# EAGLE design sanguino (EAGLE 5.10)
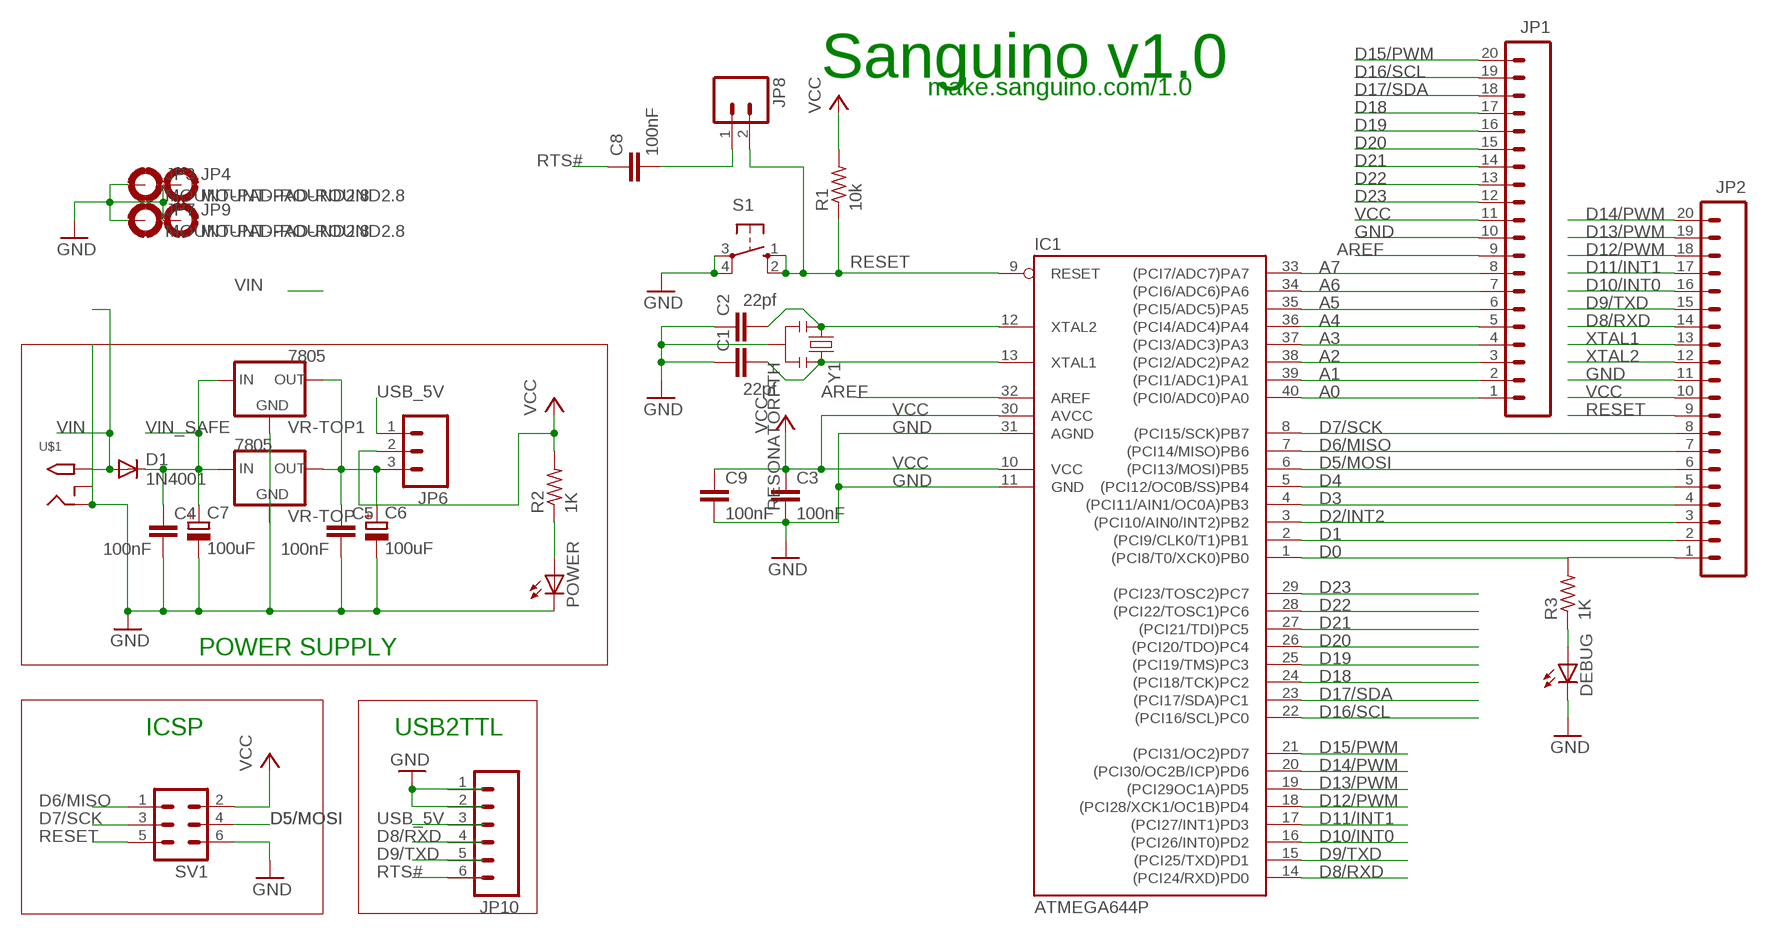
[diagram p0: schematic, sheet 1]

## Parts
C1  22pf  C-EU025-025X050  [C025-025X050]
C2  22pf  C-EU025-025X050  [C025-025X050]
C3  100nF  C-EU050-030X075  [C050-030X075]
C4  100nF  C-EU050-030X075  [C050-030X075]
C5  100nF  C-EU050-030X075  [C050-030X075]
C6  100uF  CPOL-EUE2.5-6  [E2,5-6]
C7  100uF  CPOL-EUE2.5-6  [E2,5-6]
C8  100nF  C-EU050-030X075  [C050-030X075]
C9  100nF  C-EU050-030X075  [C050-030X075]
D1  1N4001  1N4004  [DO41-10]
DEBUG  LED3MM  [LED3MM]
IC1  ATMEGA644P  ATMEGA644-20P  [DIL40]
JP1  M20LOCK  [1X20_LOCK]
JP2  M20LOCK  [1X20_LOCK]
JP3  MOUNT-PAD-ROUND2.8  [2,8-PAD]
JP4  MOUNT-PAD-ROUND2.8  [2,8-PAD]
JP6  M03LOCK  [1X03_LOCK]
JP7  MOUNT-PAD-ROUND2.8  [2,8-PAD]
JP8  M02LOCK  [1X02_LOCK]
JP9  MOUNT-PAD-ROUND2.8  [2,8-PAD]
JP10  M06LOCK  [1X06_LOCK]
POWER  LED3MM  [LED3MM]
R1  10k  R-US_0207/2V  [0207/2V]
R2  1K  R-US_0207/2V  [0207/2V]
R3  1K  R-US_0207/7  [0207/7]
S1  10-XX  [B3F-10XX]
SV1  ML6  [ML6]
U$1  2.1MMJACKTHM  [PJ-102A-DOUBLE_SIDED]
VR-TOP  7805  V_REG_78XXSINK  [TO220-IGO]
VR-TOP1  7805  V_REG_78XXSINK  [TO220-IGO]
Y1  RESONATORPTH  [RESONATOR-PTH]

## Nets
A0: IC1.40((PCI0/ADC0)PA0) JP1.1
A1: IC1.39((PCI1/ADC1)PA1) JP1.2
A2: IC1.38((PCI2/ADC2)PA2) JP1.3
A3: IC1.37((PCI3/ADC3)PA3) JP1.4
A4: IC1.36((PCI4/ADC4)PA4) JP1.5
A5: IC1.35((PCI5/ADC5)PA5) JP1.6
A6: IC1.34((PCI6/ADC6)PA6) JP1.7
A7: IC1.33((PCI7/ADC7)PA7) JP1.8
AREF: IC1.32(AREF) JP1.9
D0: IC1.1((PCI8/T0/XCK0)PB0) JP2.1 R3.2
D1: IC1.2((PCI9/CLK0/T1)PB1) JP2.2
D2/INT2: IC1.3((PCI10/AIN0/INT2)PB2) JP2.3
D3: IC1.4((PCI11/AIN1/OC0A)PB3) JP2.4
D4: IC1.5((PCI12/OC0B/SS)PB4) JP2.5
D5/MOSI: IC1.6((PCI13/MOSI)PB5) JP2.6 SV1.4
D6/MISO: IC1.7((PCI14/MISO)PB6) JP2.7 SV1.1
D7/SCK: IC1.8((PCI15/SCK)PB7) JP2.8 SV1.3
D8/RXD: IC1.14((PCI24/RXD)PD0) JP2.14 JP10.4
D9/TXD: IC1.15((PCI25/TXD)PD1) JP2.15 JP10.5
D10/INT0: IC1.16((PCI26/INT0)PD2) JP2.16
D11/INT1: IC1.17((PCI27/INT1)PD3) JP2.17
D12/PWM: IC1.18((PCI28/XCK1/OC1B)PD4) JP2.18
D13/PWM: IC1.19((PCI29OC1A)PD5) JP2.19
D14/PWM: IC1.20((PCI30/OC2B/ICP)PD6) JP2.20
D15/PWM: IC1.21((PCI31/OC2)PD7) JP1.20
D16/SCL: IC1.22((PCI16/SCL)PC0) JP1.19
D17/SDA: IC1.23((PCI17/SDA)PC1) JP1.18
D18: IC1.24((PCI18/TCK)PC2) JP1.17
D19: IC1.25((PCI19/TMS)PC3) JP1.16
D20: IC1.26((PCI20/TDO)PC4) JP1.15
D21: IC1.27((PCI21/TDI)PC5) JP1.14
D22: IC1.28((PCI22/TOSC1)PC6) JP1.13
D23: IC1.29((PCI23/TOSC2)PC7) JP1.12
GND: C1.1 C2.1 C3.2 C4.2 C5.2 C6.- C7.- C9.2 DEBUG.K(C) IC1.11(GND) IC1.31(AGND) JP1.10 JP2.11 JP3.B2,8(MOUNT) JP4.B2,8(MOUNT) JP7.B2,8(MOUNT) JP9.B2,8(MOUNT) JP10.1 JP10.2 POWER.K(C) S1.3(P) S1.4(P1) SV1.6 U$1.RING VR-TOP1.GND VR-TOP.GND Y1.2
N$4: POWER.A R2.1
N$7: DEBUG.A R3.1
N$21: C8.2 JP8.1
RESET: IC1.9(RESET) JP2.9 JP8.2 R1.1 S1.1(S) S1.2(S1) SV1.5
RTS#: C8.1 JP10.6
USB_5V: JP6.1 JP10.3
VCC [power]: C3.1 C9.1 IC1.10(VCC) IC1.30(AVCC) JP1.11 JP2.10 JP6.2 R1.2 R2.2 SV1.2
VIN [power]: D1.A U$1.TIP
VIN_SAFE [power]: C4.1 C7.+ D1.C VR-TOP1.IN VR-TOP.IN
VREG-OUT: C5.1 C6.+ JP6.3 VR-TOP1.OUT VR-TOP.OUT
XTAL1: C1.2 IC1.13(XTAL1) JP2.13 Y1.3
XTAL2: C2.2 IC1.12(XTAL2) JP2.12 Y1.1
Unconnected: U$1.RING_SW

## Notes on the sheet
- Sanguino v1.0
- make.sanguino.com/1.0
- POWER SUPPLY
- ICSP | USB2TTL

## Library data of the parts
C1-C5 C8 C9 = rcl:C-EU: CAPACITOR, European symbol
C6 C7 = rcl:CPOL-EU: POLARIZED CAPACITOR, European symbol
D1 = diode:1N4004: DIODE general purpose rectifier, 1 A
DEBUG POWER = led:LED: LED OSRAM: - CHIPLED LG R971, LG N971, LY N971, LG Q971, LY Q971, LO R971, LY R971 LH N974, LH R974 LS Q976, LO Q976, LY Q976 LO Q996 - Hyper CHIPLED LW Q18S LB Q993, LB Q99A, LB R99A - SideLED LS A670, LO A670, LY A670, LG A670, LP A670 LB A673, LV A673, LT A673, LW A673 LH A674 LY A675 LS A676, LA A676, LO A676, LY A676, LW A676 LS A679, LY A679, LG A679 - Hyper Micro SIDELED® LS Y876, LA Y876, LO Y876, LY Y876 LT Y87S - SmartLED LW L88C, LW L88S LB L89C, LB L89S, LG L890 LS L89K, LO L89K, LY L89K LS L896, LA L896, LO L896, LY L896 - TOPLED LS T670, LO T670, LY T670, LG T670, LP T670 LSG T670, LSP T670, LSY T670, LOP T670, LYG T670 LG T671, LOG T671, LSG T671 LB T673, LV T673, LT T673, LW T673 LH T674 LS T676, LA T676, LO T676, LY T676, LB T676, LH T676, LSB T676, LW T676 LB T67C, LV T67C, LT T67C, LS T67K, LO T67K, LY T67K, LW E67C LS E67B, LA E67B, LO E67B, LY E67B, LB E67C, LV E67C, LT E67C LW T67C LS T679, LY T679, LG T679 LS T770, LO T770, LY T770, LG T770, LP T770 LB T773, LV T773, LT T773, LW T773 LH T774 LS E675, LA E675, LY E675, LS T675 LS T776, LA T776, LO T776, LY T776, LB T776 LHGB T686 LT T68C, LB T68C - Hyper Mini TOPLED® LB M676 - Mini TOPLED Santana® LG M470 LS M47K, LO M47K, LY M47K Source: http://www.osram.convergy.de - LUMILED® LXK2-PW12-R00, LXK2-PW12-S00, LXK2-PW14-U00, LXK2-PW14-V00 LXK2-PM12-R00, LXK2-PM12-S00, LXK2-PM14-U00 LXK2-PE12-Q00, LXK2-PE12-R00, LXK2-PE12-S00, LXK2-PE14-T00, LXK2-PE14-U00 LXK2-PB12-K00, LXK2-PB12-L00, LXK2-PB12-M00, LXK2-PB14-N00, LXK2-PB14-P00, LXK2-PB14-Q00 LXK2-PR12-L00, LXK2-PR12-M00, LXK2-PR14-Q00, LXK2-PR14-R00 LXK2-PD12-Q00, LXK2-PD12-R00, LXK2-PD12-S00 LXK2-PH12-R00, LXK2-PH12-S00 LXK2-PL12-P00, LXK2-PL12-Q00, LXK2-PL12-R00 Source: www.luxeon.com
IC1 = avr:ATMEGA644*P: MICROCONTROLLER 64 kBytes FLASH 4 kBytes SRAM 2 kBytes EEPROM DUAL USART 8-channel 10 bit ADC
JP1 JP2 = SparkFun:M20: This is just like the LOCK variant in that the holes are staggared by 5 mil, but except for the last two holes. They are not altered from the "standard" footprint layout. This is used for a special purpose on the layout of our Graphic LCD Backpack. Make sure you want to use this device before selecting it for you project!
JP3 JP4 JP7 JP9 = holes:MOUNT-PAD-ROUND: MOUNTING PAD, round
JP6 = SparkFun:M03: Header 3 Standard 3-pin 0.1" header. Use with straight break away headers (SKU : PRT-00116), right angle break away headers (PRT-00553), swiss pins (PRT-00743), machine pins (PRT-00117), and female headers (PRT-00115). Molex polarized connector foot print use with SKU : PRT-08232 with associated crimp pins and housings.
JP8 = SparkFun:M02: Header 2 Standard 2-pin 0.1" header. Use with straight break away headers (SKU : PRT-00116), right angle break away headers (PRT-00553), swiss pins (PRT-00743), machine pins (PRT-00117), and female headers (PRT-00115). Molex polarized connector foot print use with SKU : PRT-08233 with associated crimp pins and housings.
JP10 = SparkFun:M06: Header 6 Standard 6-pin 0.1" header. Use with straight break away headers (SKU : PRT-00116), right angle break away headers (PRT-00553), swiss pins (PRT-00743), machine pins (PRT-00117), and female headers (PRT-00115). Molex polarized connector foot print use with SKU : PRT-08094 with associated crimp pins and housings. NOTES ON THE VARIANTS LOCK and LOCK_LONGPADS... This footprint was designed to help hold the alignment of a through-hole component (i.e. 6-pin header) while soldering it into place. You may notice that each hole has been shifted either up or down by 0.005 of an inch from it's more standard position (which is a perfectly straight line). This slight alteration caused the pins (the squares in the middle) to touch the edges of the holes. Because they are alternating, it causes a "brace" to hold the component in place. 0.005 has proven to be the perfect amount of "off-center" position when using our standard breakaway headers. Although looks a little odd when you look at the bare footprint, once you have a header in there, the alteration is very hard to notice. Also, if you push a header all the way into place, it is covered up entirely on the bottom side. This idea of altering the position of holes to aid alignment will be further integrated into the Sparkfun Library for other footprints. It can help hold any component with 3 or more connection pins.
R1 R3 = adafruit:R-US_: RESISTOR, American symbol
R2 = rcl:R-US_: RESISTOR, American symbol
S1 = switch-omron:10-XX: OMRON SWITCH
SV1 = con-harting-ml:ML6: HARTING
U$1 = ideabot:2.1MMJACK: 2.1mm x 5.5mm THM DC jack with internal switch. Digikey part #PJ-102A, 4UCON part #05537 2.1mm x 5.5mm SMT DC jack with internal switch. Digikey part #PJ-002A-SMT, 4UCON part #03267 By microbuilder.eu & adafruit.com
VR-TOP VR-TOP1 = SparkFun:V_REG_78XX: Voltage Regulator Standard 7805 5V regulator. IGO (Input Ground Output). Spark Fun Electronics SKU : COM-00107
Y1 = SparkFun:RESONATOR: Resonator Small SMD resonator. This is the itty bitty 10/20MHz resonators with built in caps. CSTCE10M0G55 and CSTCE20M0V53. Footprint has been reviewed closely but hasn't been tested yet.

## Net classes
0 default: width 0.635 mm, clearance 0.406 mm
1 power: width 0.635 mm, clearance 0.406 mm

## Board
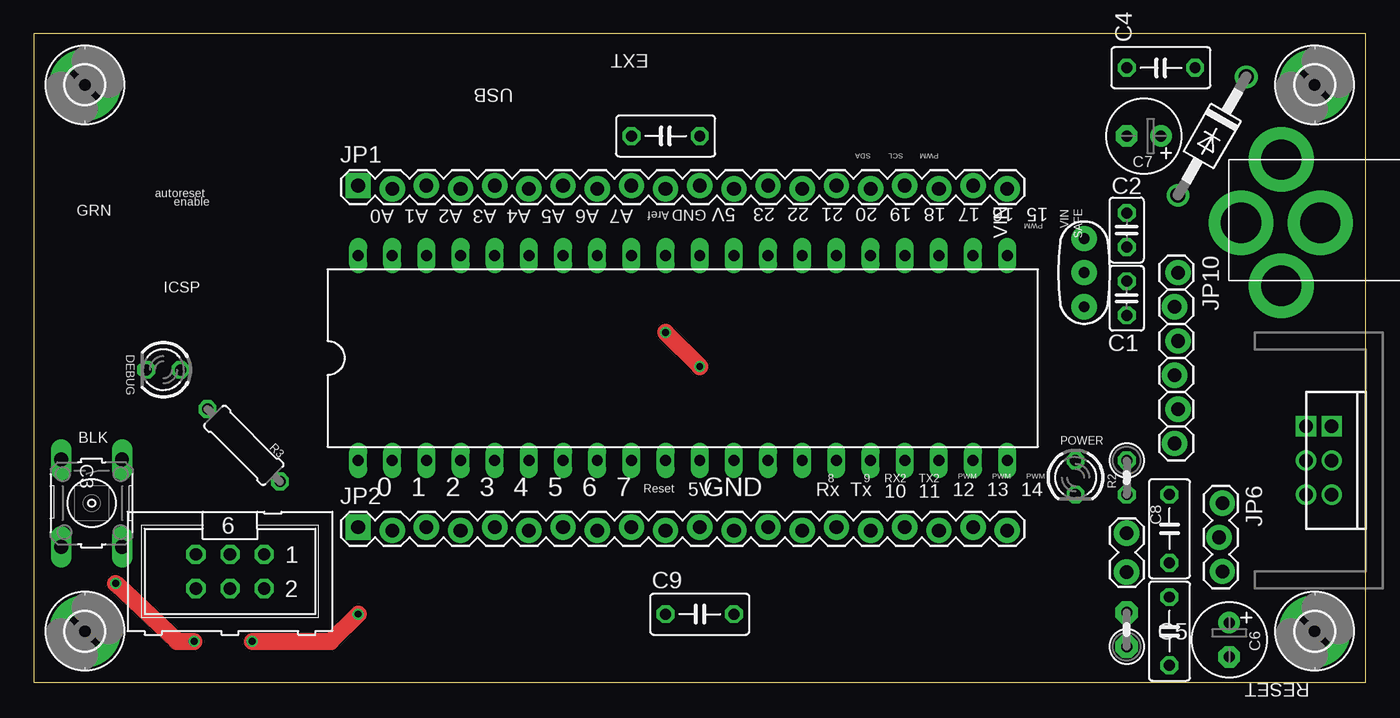
[diagram p1: board, top side]
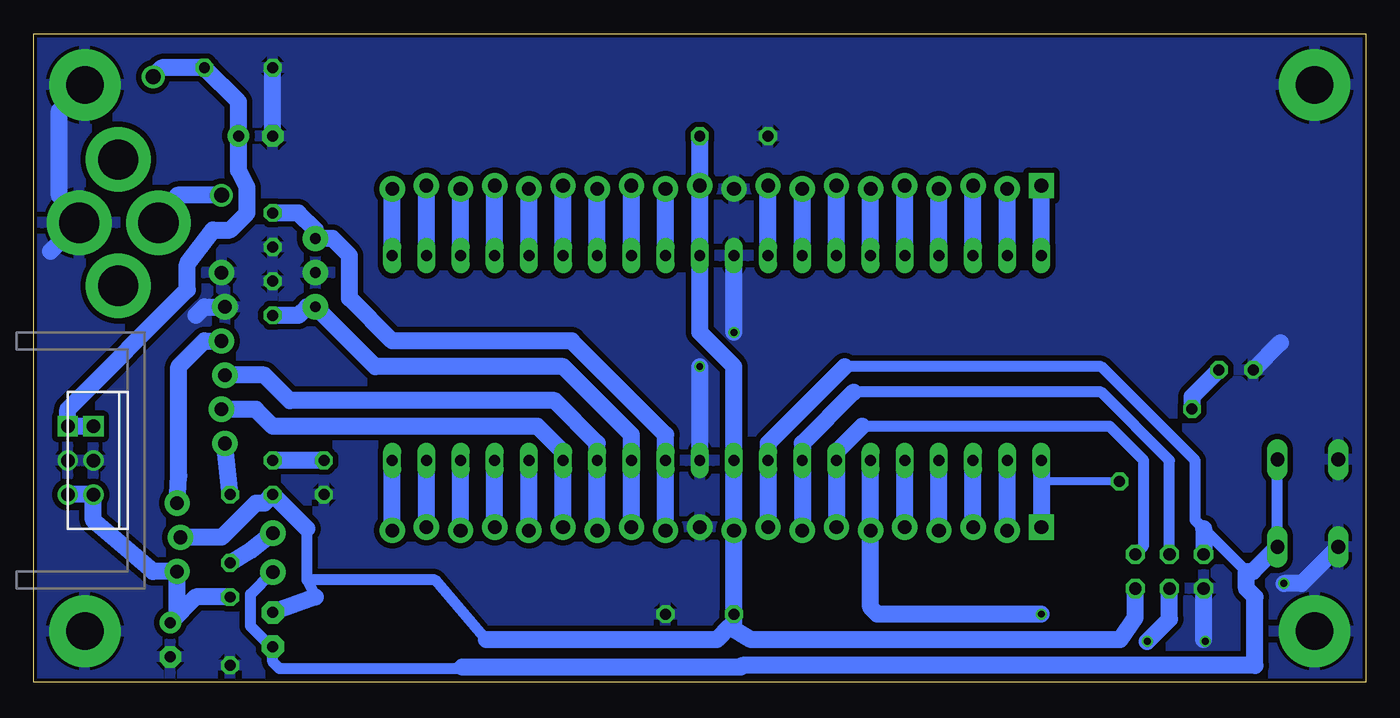
[diagram p2: board, bottom side, seen from below]

Size 99.06 x 48.26 mm. Coordinates in mm from the lower left corner, seen from the top.
Outline: 0,0 99.06,0 99.06,48.26 0,48.26 0,0
Copper layers (1*16): Top 0.035mm / dielectric 1.5mm / Bottom 0.035mm
Design rules "Fusion_eagle_rule_v1.1": minimum track width 6mil, minimum drill 12mil, track to track 6mil, track to pad 6mil, pad to pad 6mil, via to via 6mil, smd to smd 0mil, copper to edge 10mil, drill to drill 10mil, minimum pad ring 10mil, minimum via ring 6mil, stop-mask expansion 2mil, vias tented up to drill 100mil, thermal gap 10mil

### Footprints (pad centres in the part's own frame; a part is rotated, then mirrored left to right if it is on the bottom)
C025-025X050 = drill 0.813 octagon: 1 -1.27,0; 2 1.27,0
C050-030X075 = drill 0.813 octagon: 1 -2.54,0; 2 2.54,0
E2,5-6 = drill 0.813 pad 1.6 round: + -1.27,0 | drill 0.813 pad 1.6 octagon: - 1.27,0
DO41-10 = drill 1.118 round: A 5.08,0; C -5.08,0
LED3MM = drill 0.813 octagon: A -1.27,0; K 1.27,0
DIL40 = drill 0.813 long: 1 -24.13,-7.62; 2 -21.59,-7.62; 3 -19.05,-7.62; 4 -16.51,-7.62; 5 -13.97,-7.62; 6 -11.43,-7.62; 7 -8.89,-7.62; 8 -6.35,-7.62; 9 -3.81,-7.62; 10 -1.27,-7.62; 11 1.27,-7.62; 12 3.81,-7.62; 13 6.35,-7.62; 14 8.89,-7.62; 15 11.43,-7.62; 16 13.97,-7.62; 17 16.51,-7.62; 18 19.05,-7.62; 19 21.59,-7.62; 20 24.13,-7.62; 21 24.13,7.62; 22 21.59,7.62; 23 19.05,7.62; 24 16.51,7.62; 25 13.97,7.62; 26 11.43,7.62; 27 8.89,7.62; 28 6.35,7.62; 29 3.81,7.62; 30 1.27,7.62; 31 -1.27,7.62; 32 -3.81,7.62; 33 -6.35,7.62; 34 -8.89,7.62; 35 -11.43,7.62; 36 -13.97,7.62; 37 -16.51,7.62; 38 -19.05,7.62; 39 -21.59,7.62; 40 -24.13,7.62
1X20_LOCK = drill 1.016 pad 1.88 square: 1 0,0.127 | drill 1.016 pad 1.88 round: 2 2.54,-0.127; 3 5.08,0.127; 4 7.62,-0.127; 5 10.16,0.127; 6 12.7,-0.127; 7 15.24,0.127; 8 17.78,-0.127; 9 20.32,0.127; 10 22.86,-0.127; 11 25.4,0.127; 12 27.94,-0.127; 13 30.48,0.127; 14 33.02,-0.127; 15 35.56,0.127; 16 38.1,-0.127; 17 40.64,0.127; 18 43.18,-0.127; 19 45.72,0.127; 20 48.26,-0.127
2,8-PAD = drill 2.8 pad 5.334 round: B2,8 0,0
1X03_LOCK = drill 1.016 pad 1.88 round: 1 0,0.127; 2 2.54,-0.127; 3 5.08,0.127
1X02_LOCK = drill 1.016 pad 1.88 round: 1 -0.178,0; 2 2.718,0
1X06_LOCK = drill 1.016 pad 1.88 round: 1 0,0; 2 2.54,-0.254; 3 5.08,0; 4 7.62,-0.254; 5 10.16,0; 6 12.7,-0.254
0207/2V = drill 0.813 pad 1.676 octagon: 1 -1.27,0; 2 1.27,0
0207/2V' = drill 0.813 octagon: 1 -1.27,0; 2 1.27,0
0207/7 = drill 0.813 octagon: 1 -3.81,0; 2 3.81,0
B3F-10XX = drill 1.016 long: 1 -3.251,2.261; 2 3.251,2.261; 3 -3.251,-2.261; 4 3.251,-2.261
ML6 = drill 0.914 octagon: 1 -2.54,-1.27; 2 -2.54,1.27; 3 0,-1.27; 4 0,1.27; 5 2.54,-1.27; 6 2.54,1.27
PJ-102A-DOUBLE_SIDED = drill 3 pad 4.8 round: RING 0.1,-3.39; RING_SW -4.6,-6.29; RING_SW1 4.8,-6.29; TIP 0.1,-9.29
TO220-IGO = drill 1 round: GND 0,0; OUT 2.54,0 | drill 1 square: IN -2.54,0
RESONATOR-PTH = drill 0.8 pad 1.88 round: 1 -2.54,0; 2 0,0; 3 2.54,0

### Placement (x,y rotation side)
C1  81.28,28.57 270 top
C2  81.28,33.66 90 top
C3  46.99,40.64 180 top
C4  83.82,45.72 180 top
C5  84.45,3.81 270 top
C6  88.9,3.17 270 top
C7  82.55,40.64 180 top
C8  84.45,11.43 270 top
C9  49.53,5.08 0 top
D1  87.63,40.64 240 top
DEBUG  9.65,23.25 180 top
IC1  48.26,24.13 0 top
JP1  24.13,36.83 0 top
JP2  24.13,11.43 0 top
JP3  3.81,3.81 0 top
JP4  95.25,3.81 0 top
JP6  88.27,13.34 270 top
JP7  3.81,44.45 0 top
JP8  81.28,10.93 270 top
JP9  95.25,44.45 0 top
JP10  85.09,30.48 270 top
POWER  77.47,15.24 270 top
R1  81.28,3.94 90 top
R2  1K  [0207/2V']  81.28,15.24 270 top
R3  15.62,17.64 315 top
S1  4.32,13.34 270 top
SV1  14.61,8.26 180 top
U$1  99.06,34.29 270 top
VR-TOP  96.52,16.51 270 top
VR-TOP1  94.61,16.51 270 bottom
Y1  78.11,30.48 270 top

### Tracks (layer width: path | path; a pad name or v marks a point on that pad's centre or on a via)
A0
  Bottom 1.27: IC1.40 JP1.1
A1
  Bottom 1.27: IC1.39 JP1.2
A2
  Bottom 1.27: IC1.38 JP1.3
A3
  Bottom 1.27: IC1.37 JP1.4
A4
  Bottom 1.27: IC1.36 JP1.5
A5
  Bottom 1.27: IC1.35 JP1.6
A6
  Bottom 1.27: IC1.34 JP1.7
A7
  Bottom 1.27: IC1.33 JP1.8
AREF
  Bottom 1.27: IC1.32 JP1.9
D0
  Bottom 0.635: R3.2 23.75,15 24.25,16.14 IC1.1
  Bottom 1.27: IC1.1 JP2.1
D1
  Bottom 1.27: JP2.2 IC1.2
D2/INT2
  Bottom 1.27: JP2.3 IC1.3
D3
  Bottom 1.27: JP2.4 IC1.4
D4
  Bottom 1.27: JP2.5 IC1.5
D5/MOSI  (via drill 0.51)
  Top 1.27: v16.26,3.05 22.1,3.05 v24.13,5.08
  Bottom 1.27: IC1.6 JP2.6 36.83,5.59 36.32,5.08 v24.13,5.08 | SV1.4 14.61,4.7 v16.26,3.05
D6/MISO
  Bottom 0.813: 37.47,19.05 19.05,19.05 16.51,16.51 16.51,10.16 SV1.1
  Bottom 1.27: JP2.7 IC1.7 39.37,17.14 37.47,19.05
D7/SCK
  Bottom 0.813: 38.1,21.59 19.68,21.59 14.61,16.51 SV1.3
  Bottom 1.27: JP2.8 IC1.8 41.91,17.78 38.1,21.59
D8/RXD
  Bottom 1.27: JP10.4 81.92,22.86 80.01,20.95 60.33,20.95 57.15,17.78 IC1.14 JP2.14
D9/TXD
  Bottom 1.27: JP10.5 82.55,20.32 81.28,19.05 61.59,19.05 59.69,17.14 IC1.15 JP2.15
D10/INT0
  Bottom 1.27: JP2.16 IC1.16
D11/INT1
  Bottom 1.27: JP2.17 IC1.17
D12/PWM
  Bottom 1.27: JP2.18 IC1.18
D13/PWM
  Bottom 1.27: JP2.19 IC1.19
D14/PWM
  Bottom 1.27: JP2.20 IC1.20
D15/PWM
  Bottom 1.27: IC1.21 JP1.20
D16/SCL
  Bottom 1.27: IC1.22 JP1.19
D17/SDA
  Bottom 1.27: IC1.23 JP1.18
D18
  Bottom 1.27: IC1.24 JP1.17
D19
  Bottom 1.27: IC1.25 JP1.16
D20
  Bottom 1.27: IC1.26 JP1.15
D21
  Bottom 1.27: IC1.27 JP1.14
D22
  Bottom 1.27: IC1.28 JP1.13
D23
  Bottom 1.27: IC1.29 JP1.12
GND  (via drill 0.51)
  Top 1.27: v49.53,23.5 v46.99,26.04 | v11.94,3.05 10.67,3.05 v6.1,7.37
  Bottom 1.27: 97.79,32.07 U$1.RING 95.67,34.71 97.16,36.2 97.16,42.55 JP9.B2,8 | C7.- C4.2 | 84.45,27.94 86.36,27.94 87,27.3 | IC1.11 v49.53,23.5 | v46.99,26.04 IC1.31 | 6.35,25.28 DEBUG.K | 12.06,3.17 SV1.6 | v6.1,7.37 4.78,7.37 S1.4
  pour Bottom: 0,48.26 0,0 99.06,0 99.06,48.26
N$4
  Bottom 1.27: POWER.A R2.1
N$7
  Bottom 1.27: R3.1 12.93,21.24 DEBUG.A
N$21
  Bottom 1.27: JP8.1 82.88,9.84 C8.2
RESET
  Bottom 0.813: 38.73,23.5 19.68,23.5 12.7,16.51 12.7,12.06 12.06,11.43 8.89,8.26 | S1.2 S1.1 | JP8.2 82.93,6.56 82.93,4.19 81.41,2.67 R1.1 81.28,1.52 80.77,1.02 67.29,1.02 67.17,1.13
  Bottom 1.27: JP2.9 IC1.9 44.45,17.78 38.73,23.5 | 67.17,1.13 46.49,1.13 46.35,1.27 8.26,1.27 8.26,6.35 8.89,6.99 8.89,8.26 8.41,8.26 S1.2 | 12.06,11.43 SV1.5
RTS#
  Bottom 1.27: C8.1 84.85,17.77 JP10.6
USB_5V
  Bottom 1.27: JP10.3 86.36,25.4 88.27,23.5 88.27,15.37 JP6.1
VCC
  Bottom 0.813: 78.74,7.62 78.11,6.35 | 78.74,7.62 78.74,11.43 | 65.41,3.17 69.22,7.62 78.74,7.62
  Bottom 1.27: JP6.2 85.09,10.79 82.55,13.34 81.92,13.34 R2.2 78.74,11.43 | C3.1 JP1.11 IC1.30 49.53,26.04 46.99,23.5 IC1.10 JP2.10 C9.1 46.99,4.45 47.31,4.13 | 47.31,4.13 48.26,3.17 65.41,3.17 | 47.31,4.13 45.72,3.17 18.29,3.17 17.14,4.83 SV1.2 | 78.11,6.35 R1.2
VIN
  Bottom 1.27: D1.A 88.36,36.24 U$1.TIP
VIN_SAFE
  Bottom 1.27: D1.C 90.22,45.04 89.53,45.72 C4.1 83.82,43.18 C7.+ 83.82,38.1 83.19,36.83 83.19,34.92 84.45,33.66 85.72,33.66 87.63,31.11 87.63,29.21 96.52,20.32 VR-TOP.IN VR-TOP1.IN
VREG-OUT
  Bottom 1.27: C5.1 87,6.35 C6.+ 88.39,4.95 JP6.3 90.17,8.26 94.61,12.06 VR-TOP1.OUT VR-TOP.OUT
XTAL1
  Bottom 1.27: C1.2 79.38,27.3 78.74,27.94 Y1.3 73.66,23.5 59.69,23.5 54.61,18.41 IC1.13 JP2.13
XTAL2
  Bottom 1.27: C2.2 79.38,34.92 78.11,33.66 Y1.1 76.83,33.02 75.56,31.75 75.56,28.57 72.39,25.4 59.05,25.4 52.07,18.41 IC1.12 JP2.12

### Text on the board
tPlace: EXT | USB | SDA | SCL | PWM | autoreset | GRN | enable | A0 | A1 | A2 | A3 | A4 | A5 | A6 | A7 | Aref | GND | 5V | 23 | 22 | 21 | 20 | 19 | 18 | 17 | 16 | 15 | PWM | VIN | VIN | SAFE | ICSP | BLK | C3 | 8 | 9 | RX2 | TX2 | PWM | PWM | PWM | 0 | 1 | 2 | 3 | 4 | 5 | 6 | 7 | Reset | 5V | GND | Rx | Tx | 10 | 11 | 12 | 13 | 14 | RESET